# Altium schematic sheet PM.SchDoc
size A2; SPICEModelCacheVCNMBYVH: <root> / <DocumentId>VCNMBYVH</DocumentId> / <CacheFrame Number="0"> / <Model Name="mcp65r41_2402" Kind="CKT"> / <Text>.SUBCKT MCP65R41_2402 1 2 3 4 5 6 / *                     | | | | | | / *                     | | | | | VRef / *                     | | | | Output / *                     | | | Negative Supply / *                     | | Positive Supply / *                     | Inverting Input / *                     Non-inverting Input / * / ******************************************************************************** / * Software License Agreement                                                   * / *                                                                              * / * The software supplied herewith by Microchip Technology Incorporated (the     * / * 'Company') is intended and supplied to you, the Company's customer, for use  * / * soley and exclusively on Microchip products.                                 * / *                                                                              * / * The software is owned by the Company and/or its supplier, and is protected   * / * under applicable copyright laws. All rights are reserved. Any use in         * / * violation of the foregoing restrictions may subject the user to criminal     * / * sanctions under applicable laws, as well as to civil liability for the       * / * breach of the terms and conditions of this license.                          * / *                                                                              * / * THIS SOFTWARE IS PROVIDED IN AN 'AS IS' CONDITION. NO WARRANTIES, WHETHER    * / * EXPRESS, IMPLIED OR STATUTORY, INCLUDING, BUT NOT LIMITED TO, IMPLIED        * / * WARRANTIES OF MERCHANTABILITY AND FITNESS FOR A PARTICULAR PURPOSE APPLY TO  * / * THIS SOFTWARE. THE COMPANY SHALL NOT, IN ANY CIRCUMSTANCES, BE LIABLE FOR    * / * SPECIAL, INCIDENTAL OR CONSEQUENTIAL DAMAGES, FOR ANY REASON WHATSOEVER.     * / ******************************************************************************** / * / * The following op-amps are covered by this model: / *      MCP65R41_2402 / * / * / * Revision History: / *      REV A: 19-May-11, Created model / * / * / * / * / * Recommendations: / *      Use PSPICE (or SPICE 2G6; other simulators may require translation) / *      For a quick, effective design, use a combination of: data sheet / *            specs, bench testing, and simulations with this macromodel / *      For high impedance circuits, set GMIN=100F in the .OPTIONS statement / *      Can disable Hysteresis for faster response in large circuits by adding comments / *      in front of statements flagged below / * / * Supported: / *      Typical performance for temperature range (-40 to 125) degrees Celsius / *      DC, AC, Transient, and Noise analyses. / *      Most specs, including: offsets, DC PSRR, DC CMRR, input impedance, / *            open loop gain, voltage ranges, supply current, ... , etc. / *      Temperature effects for Ibias, Iquiescent, Iout short circuit / *            current, Vsat on both rails, Slew Rate vs. Temp and P.S. / * / * Not Supported: / *      Some Variation in specs vs. Power Supply Voltage / *      Vos distribution, Ib distribution for Monte Carlo / *      Distortion (detailed non-linear behavior) / *      Some Temperature analysis / *      Process variation / *      Behavior outside normal operating region / * / * / * / * Input Stage / * / V10  3 10 -500M / R10 10 11 218K / R11 10 12 218K / G10 10 11 10 11 458U / G11 10 12 10 12 458U / C11 11 12 1.82E-15 / C12  1  0 4.00P / *E12 71 14 POLY(6) 20 0 21 0 22 0 23 0 26 0 27 0   0.00 49.3K 49.3K 49.3K 49.3K 1 1 / E12 71 14 POLY(7) 20 0 21 0 22 0 23 0 26 0 27 0 111 0 / + 0.00 55 55 15 15 1 1 -.5M / *+ 1.5M 55 55 15 15 1 1 -.5M / * LINE ABOVE FOR HYSTERESIS, LINE BELOW FOR NO HYSTERESIS / *+ 1.5M 55 55 15 15 1 1 0 / G12 1 0 62 0 1m / G13 1 2 63 0 1u / M12 11 14 15 15 NMI / M14 12 2 15 15 NMI / G14 2 0 62 0 1m / C14  2  0 4.00P / I15 15 4 500U / V16 16 4 -300M / GD16 16 1 TABLE {V(16,1)} ((-100,-100E-15)(0,0)(1m,1u)(2m,1m)) / V13 3 13 -300M / GD13 2 13 TABLE {V(2,13)} ((-100,-100E-15)(0,0)(1m,1u)(2m,1m)) / R71  1  0 10.0E12 / R72  2  0 10.0E12 / R73  1  2 10.0E12 / C13  1  2 2.00P / * / * Noise, PSRR, and CMRR / * / I20 21 20 423U / D20 20  0 DN1 / D21  0 21 DN1 / I22 22 23 1N / R22 22 0  1k / R23  0 23 1k / G26  0 26 POLY(2) 3 0 4 0   0.00 -70.7U -125U / R26 26  0 1 / G27  0 27 POLY(2) 1 0 2 0  -2.19M 125U 125U / R27 27  0 1 / * / * Open Loop Gain, Slew Rate / * / G30  0 30 12 11 1 / R30 30  0 1.00K / G31 0 31 3 4 18.6 / I31 0 31 DC -82.1M / R31 31  0 1 TC=0.00,0.00 / GD31 30 0 TABLE {V(30,31)} ((-100,-1n)(0,0)(1m,0.1)(2m,2)) / G32 32 0 3 4 18.6 / I32 32 0 DC -82.1M / R32 32  0 1 TC=0.00,0.00 / GD32 0 30 TABLE {V(30,32)} ((-2m,2)(-1m,0.1)(0,0)(100,-1n)) / G33  0 33 30 0 1m / R33  33 0 1K / G34  0 34 33 0 1.00 / R34  34 0 1K / C34  34 0 15.9U / G37  0 37 34 0 1m / R37  37 0 1K / C37  37 0 15.9E-15 / G38  0 38 37 0 1m / R38  39 0 1K / L38  38 39 15.9N / E38  35 0 38 0 1 / G35 33 0 TABLE {V(35,3)} ((-1,-1n)(0,0)(2.00,1n))(2.2,1)) / G36 33 0 TABLE {V(35,4)} ((-2.2,-1)((-2.00,-1n)(0,0)(1,1n)) / * / * Output Stage / * / R80 50 0 100MEG / G50 0 50 57 96 2 / R58 57  96 0.50 / R57 57  0 10.0 / C58  5  0 2.00P / G57  0 57 POLY(3) 3 0 4 0 35 0 0 37.5M 50.0M 100M / GD55 55 57 TABLE {V(55,57)} ((-2m,-1)(-1m,-1m)(0,0)(10,1n)) / GD56 57 56 TABLE {V(57,56)} ((-2m,-1)(-1m,-1m)(0,0)(10,1n)) / E55 55  0 POLY(2) 3 0 51 0 4.7M 1 -48.5M / E56 56  0 POLY(2) 4 0 52 0 9.9M 1 -36.5M / R51 51 0 1k / R52 52 0 1k / GD51 50 51 TABLE {V(50,51)} ((-10,-1n)(0,0)(1m,1m)(2m,1)) / GD52 50 52 TABLE {V(50,52)}  ((-2m,-1)(-1m,-1m)(0,0)(10,1n)) / G53  3  0 POLY(1) 51 0  -500U 1M / G54  0  4 POLY(1) 52 0  -500U -1M / * / * Current Limit / * / G99 96 5 99 0 1 / R98 0 98 1 TC=-2.45M,-4.74U / G97 0 98 TABLE { V(96,5) } ((-11.0,-14.0M)(-1.00M,-13.8M)(0,0)(1.00M,13.8M)(11.0,14.0M)) / *E97 99 0 VALUE { V(98)*((V(3)-V(4))*738M + -1.21)} / E97 99 0 VALUE { V(98)*LIMIT(((V(3)-V(4))*738M + -1.21),0.00,1E6)} / D98 4 5 DESD / D99 5 3 DESD / * / * Temperature / Voltage Sensitive IQuiscent / * / R61 0 61 1 TC=3.54M,-1.28U / G61 3 4 61 0 1 / G60 0 61 TABLE {V(3, 4)} / *+ ((0,0)(600M,25.1N)(1.8,2.5U)(2.00,2.5U) / + ((0,0)(600M,25.1N)(0.85,0.50u)(1.15,2.5u)(1.2,3u)(1.35,3.7u)(1.4,3.8u)(1.45,3.7u)(1.5,2.5u)(1.8,2.5U)(2.00,2.5U) / + (3.00,2.5U)(5.00,2.51U)(6.00,2.52U)) / * / * Temperature Sensitive offset voltage / * / I73 0 70 DC 1uA / *R74 0 70 1 TC=10.0 / R74 0 70 1 TC=0.00 / E75 1 71 70 0 1 / * / * Temp Sensistive IBias / * / I62 0 62 DC 1uA / R62 0 62 REXP  349.81393U / * / * Temp Sensistive Offset IBias / * / I63 0 63 DC 1uA / R63 0 63 200M TC=12.0M,128U / * / * Hysteresis / * / G110 0 110 POLY(2) 3 0 4 0  10.4 -50M 50M / R110 110 0 1 TC=0.5M,0 / E111 111 0 VALUE { V(110) * V(112) } / E112 112 0 TABLE {V(120,0)} ((-1,1)(-1m,0.99)(1m,-0.99)(1,-1)) / C120  120 0  1u / G120 0 120 TABLE {V(57,4)} ((-1m,-1)(1m,1)) / R120 0 120 1 / C121 121 120 2p / C122 122 120 2p / V121 121 0 1 / V122 122 0 -1 / * Node 120 above is output of FF.  Can substitute with node 57 for / * direct input from output state. / * / * Begin - VRef Subcircuit Added 05-16-11 / * / R200 4 200  1 TC=3.35e-5,-4.55e-7 / E200 201 4 200 4 1 / VF200 202 6 0 / F200 3 4 VF200 1 / G200 201 202 TABLE { V(201, 202) } / + ( (-5.5,-0.010)(-1u,-500u)(0,0) (1u,500u)(5.5,0.012) ) / G201 4 200 TABLE { V(3, 4) } / + ( (0,0)(1.79,0.0)(1.80,1.80)(2.35,2.35)(2.37,2.37)(2.39,2.39)(2.40,2.40)(5.5,2.40)) / * / * End - VRef Subcircuit / * / * Models / .MODEL NMI NMOS(L=2.00U W=42.0U KP=20.0U LEVEL=1 ) / .MODEL DESD  D   N=1 IS=1.00E-15 / .MODEL DN1 D   IS=1P KF=50.0P AF=1 / .MODEL REXP  RES TCE= 7.71929 / .ENDS MCP65R41_2402</Text> / </Model> / </CacheFrame> / </root>
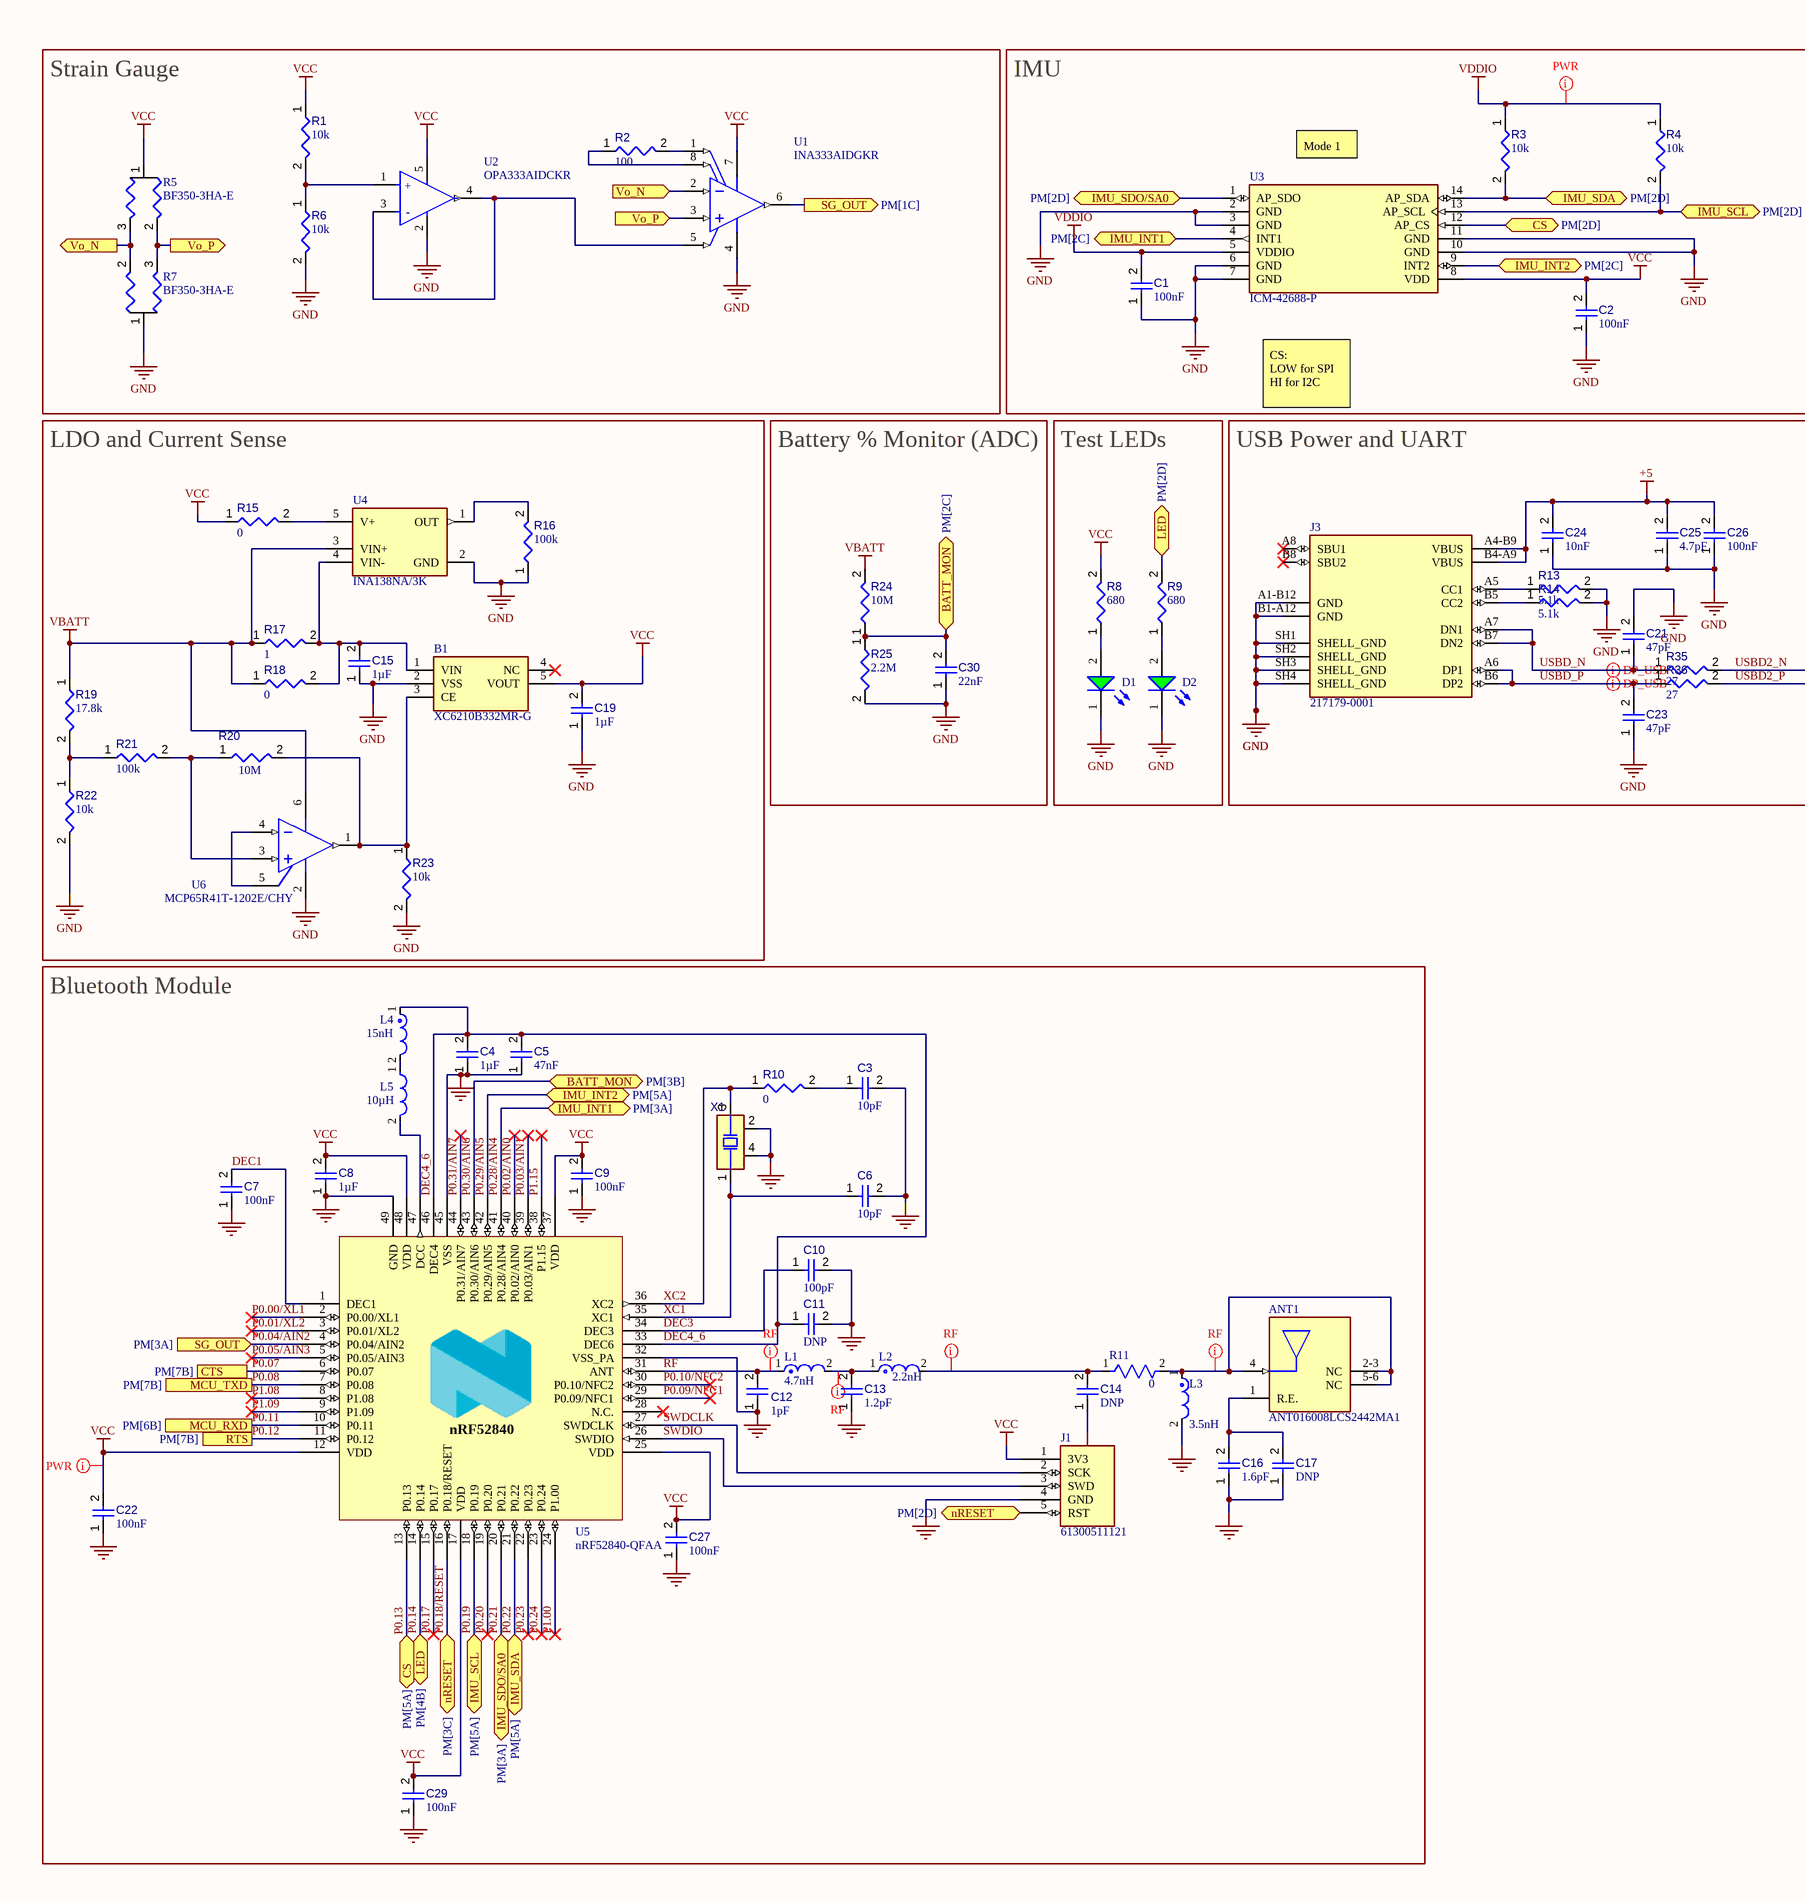
[diagram p0: PM.SchDoc, left]
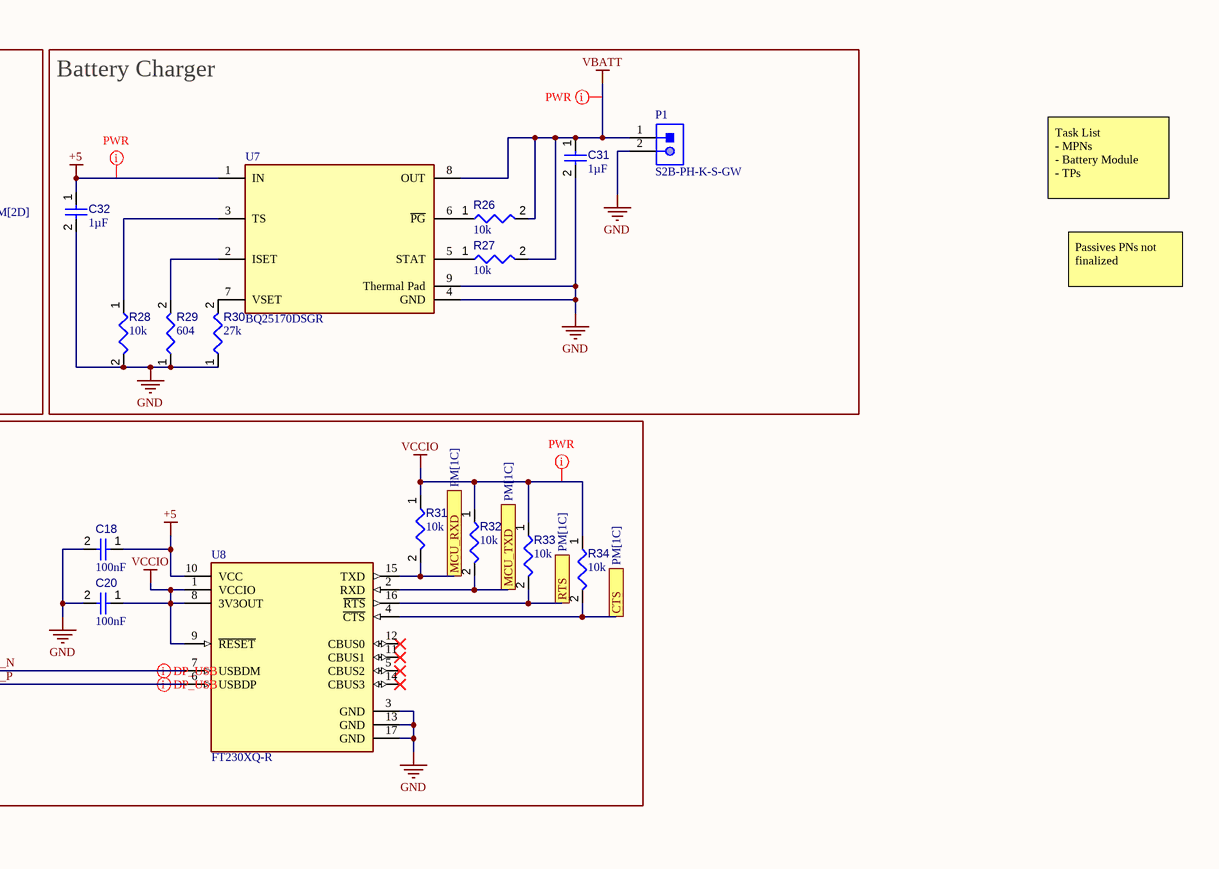
[diagram p1: PM.SchDoc, right]

## Parts
ANT1  ANT016008LCS2442MA1  [FP-ANT016-MFG]
B1  XC6210B332MR-G  [SOT95P280X130-5N]
C1  value 100nF  [FP-GRM15-IPC_B]  (hidden comment: GRM155R71C104KA88D)
C2  value 100nF  [FP-GRM15-IPC_B]  (hidden comment: GRM155R71C104KA88D)
C3  value 10pF  [FP-GRM155-0_05-IPC_C]  (hidden comment: GRM1555C1H100FA01D)
C4  value 1µF  [FP-GRM155-0_05-IPC_C]  (hidden comment: GRM155R70J105KA12D)
C5  value 47nF  [CAPC1608X90X35LL10T15]  (hidden comment: GRM188R71H473KA61D)
C6  value 10pF  [FP-GRM155-0_05-IPC_C]  (hidden comment: GRM1555C1H100FA01D)
C7  value 100nF  [FP-GRM15-IPC_B]  (hidden comment: GRM155R71C104KA88D)
C8  value 1µF  [FP-GRM155-0_05-IPC_C]  (hidden comment: GRM155R70J105KA12D)
C9  value 100nF  [FP-GRM15-IPC_B]  (hidden comment: GRM155R71C104KA88D)
C10  value 100pF  [CAPC1005X55X25LL05T10]  (hidden comment: GRM1555C1H101JA01D)
C11  value DNP  [CAPC0402(1005)33_L]  (hidden comment: Capacitor 680pF +/-20% 50V 0402)
C12  GJM0335C1H1R0BB01D  [FP-GJM033-0_03-IPC_B]  (value not drawn)
C13  value 1.2pF  [FP-GJM033-0_03-IPC_B]  (hidden comment: GJM0335C1H1R2BB01D)
C14  value DNP  [FP-GJM033-0_03-IPC_B]  (hidden comment: GJM0335C1H1R6BB01D)
C15  value 1µF  [FP-GRM155-0_05-IPC_C]  (hidden comment: GRM155R70J105KA12D)
C16  value 1.6pF  [FP-GJM033-0_03-ANT]  (hidden comment: GJM0335C1H1R6BB01D)
C17  value DNP  [FP-GJM033-0_03-ANT]  (hidden comment: GJM0335C1H1R6BB01D)
C18  value 100nF  [FP-GRM15-IPC_B]  (hidden comment: GRM155R71C104KA88D)
C19  value 1µF  [FP-GRM155-0_05-IPC_C]  (hidden comment: GRM155R70J105KA12D)
C20  value 100nF  [FP-GRM15-IPC_B]  (hidden comment: GRM155R71C104KA88D)
C21  value 47pF  [CAPC1005X55X25LL05T10]  (hidden comment: GRM1555C1H470JA01D)
C22  value 100nF  [FP-GRM15-IPC_B]  (hidden comment: GRM155R71C104KA88D)
C23  value 47pF  [CAPC1005X55X25LL05T10]  (hidden comment: GRM1555C1H470JA01D)
C24  value 10nF  [CAPC1005X55X25LL05T10]  (hidden comment: GRM155R71E103KA01D)
C25  value 4.7pF  [FP-GRM155-0_05-IPC_B]  (hidden comment: GRM1555C1H4R7CA01D)
C26  value 100nF  [FP-GRM15-IPC_B]  (hidden comment: GRM155R71C104KA88D)
C27  value 100nF  [FP-GRM15-IPC_B]  (hidden comment: GRM155R71C104KA88D)
C29  value 100nF  [FP-GRM15-IPC_B]  (hidden comment: GRM155R71C104KA88D)
C30  value 22nF  [FP-GRM155-0_05-MFG]  (hidden comment: GRM155R71E223JA61D)
C31  value 1µF  [FP-GRM155-0_05-IPC_C]  (hidden comment: GRM155R70J105KA12D)
C32  value 1µF  [FP-GRM155-0_05-IPC_C]  (hidden comment: GRM155R70J105KA12D)
D1  APHHS1005LCGCK  [LED_APHHS1005LCGCK]  (value not drawn)
D2  APHHS1005LCGCK  [LED_APHHS1005LCGCK]  (value not drawn)
J1  61300511121  [61300511121]
J3  217179-0001  [FP-2171790001-MFG]
L1  value 4.7nH  [FP-LQP03PN_02-IPC_B]  (hidden comment: LQP03PN4N7J02D)
L2  LQP03TN2N2B02D  [FP-LQP03TG_02-IPC_B]  (value not drawn)
L3  LQP03TN3N5B02D  [FP-LQP03TG_02-IPC_B]  (value not drawn)
L4  value 15nH  [FP-LQG15HH_02-IPC_B]  (hidden comment: LQG15HS15NJ02D)
L5  value 10µH  [FP-LQM18DN_70-IPC_C]  (hidden comment: LQM18DN100M70L)
P1  S2B-PH-K-S-GW  [JST-S2B-PH-K-S_V]
R1  value 10k  [FP-ERA2A-IPC_C]  (hidden comment: ERA-2AEB103X)
R2  value 100  [RESC1005X40X25NL05T05]  (hidden comment: ERJ-2GEJ101X)
R3  value 10k  [FP-ERA2A-IPC_C]  (hidden comment: ERA-2AEB103X)
R4  value 10k  [FP-ERA2A-IPC_C]  (hidden comment: ERA-2AEB103X)
R5  BF350-3HA-E  [BF350-3HA-E-Footprint-1]
R6  value 10k  [FP-ERA2A-IPC_C]  (hidden comment: ERA-2AEB103X)
R7  BF350-3HA-E  [BF350-3HA-E-Footprint-1]
R8  value 680  [FP-ERJ3EK-IPC_C]  (hidden comment: ERJ-3EKF6800V)
R9  value 680  [FP-ERJ3EK-IPC_C]  (hidden comment: ERJ-3EKF6800V)
R10  value 0  [RESC0402(1005)_L]  (hidden comment: ERJ-2GE0R00X)
R11  value 0  [FP-ERJ1GN-IPC_B]  (hidden comment: ERJ-1GN0R00C)
R13  value 5.1k  [RESC1005X40X25NL05T05]  (hidden comment: ERJ-2GEJ512X)
R14  value 5.1k  [RESC1005X40X25NL05T05]  (hidden comment: ERJ-2GEJ512X)
R15  value 0  [RESC0402(1005)_L]  (hidden comment: ERJ-2GE0R00X)
R16  value 100k  [RESC1005X40X25NL05T05]  (hidden comment: Resistor 100k +/-1% 0402 100 mW)
R17  value 1  [RESC1005X40X25NL05T10]  (hidden comment: RC0402FR-071RL)
R18  value 0  [RESC0402(1005)_L]  (hidden comment: ERJ-2GE0R00X)
R19  value 17.8k  [RESC1005X40X25NL05T10]  (hidden comment: RC0402FR-0717K8L)
R20  value 10M  [RESC1005X40N]  (hidden comment: RC0402FR-0710ML)
R21  value 100k  [RESC1005X40X25NL05T05]  (hidden comment: Resistor 100k +/-1% 0402 100 mW)
R22  value 10k  [FP-ERA2A-IPC_C]  (hidden comment: ERA-2AEB103X)
R23  value 10k  [FP-ERA2A-IPC_C]  (hidden comment: ERA-2AEB103X)
R24  value 10M  [RESC1005X40N]  (hidden comment: RC0402FR-0710ML)
R25  value 2.2M  [FP-CRCW0402-e3-IPC_B]  (hidden comment: CRCW04022M20FKED)
R26  value 10k  [FP-ERA2A-IPC_C]  (hidden comment: ERA-2AEB103X)
R27  value 10k  [FP-ERA2A-IPC_C]  (hidden comment: ERA-2AEB103X)
R28  value 10k  [FP-ERA2A-IPC_C]  (hidden comment: ERA-2AEB103X)
R29  value 604  [RESC1005X40X25NL05T05]  (hidden comment: ERJ-2RKF6040X)
R30  value 27k  [RESC1005X40X25NL05T05]  (hidden comment: ERJ-2RKF2702X)
R31  value 10k  [FP-ERA2A-IPC_C]  (hidden comment: ERA-2AEB103X)
R32  value 10k  [FP-ERA2A-IPC_C]  (hidden comment: ERA-2AEB103X)
R33  value 10k  [FP-ERA2A-IPC_C]  (hidden comment: ERA-2AEB103X)
R34  value 10k  [FP-ERA2A-IPC_C]  (hidden comment: ERA-2AEB103X)
R35  value 27  [RESC1005X40X25ML05T05]  (hidden comment: ERJ-2GEJ270X)
R36  value 27  [RESC1005X40X25ML05T05]  (hidden comment: ERJ-2GEJ270X)
U1  INA333AIDGKR  [DGK0008A_M]
U2  OPA333AIDCKR  [FP-DCK0005A-MFG]
U3  ICM-42688-P  [PQFN50P300X250X97-14N]
U4  INA138NA/3K  [FP-DBV0005A-IPC_C]
U5  nRF52840-QFAA  [QFN40P600X600X90-48N]
U6  MCP65R41T-1202E/CHY  [SOT-23-CHY6_M]
U7  BQ25170DSGR  [FP-DSG0008A-IPC_B]
U8  FT230XQ-R  [FP-QFN-16-IPC_A]
X1  FA-128 32.0000MF20X-K5  [BT-XTAL_2016]  (value not drawn)

## Blocks framed on the sheet
Strain Gauge: R1 R2 R5-R7 U1 U2
IMU: C1 C2 R3 R4 U3
Battery Charger: C31 C32 P1 R26-R30 U7
LDO and Current Sense: B1 C15 C19 R15-R23 U4 U6
Battery % Monitor (ADC): C30 R24 R25
Test LEDs: D1 D2 R8 R9
USB Power and UART: C18 C20 C21 C23-C26 J3 R13 R14 R31-R36 U8
Bluetooth Module: ANT1 C3-C14 C16 C17 C22 C27 C29 J1 L1-L5 R10 R11 U5 X1

## Ports
BATT_MON (bidir, see PM[2C]), BATT_MON (bidir, see PM[3B]), CS (bidir, see PM[2D]), CS (bidir, see PM[5A]), CTS (see PM[1C]), CTS (see PM[7B]), IMU_INT1 (bidir, see PM[2C]), IMU_INT1 (bidir, see PM[3A]), IMU_INT2 (bidir, see PM[2C]), IMU_INT2 (bidir, see PM[5A]), IMU_SCL (bidir, see PM[2D]), IMU_SCL (bidir, see PM[5A]), IMU_SDA (bidir, see PM[2D]), IMU_SDA (bidir, see PM[5A]), IMU_SDO/SA0 (bidir, see PM[2D]), IMU_SDO/SA0 (bidir, see PM[3A]), LED (bidir, see PM[2D]), LED (bidir, see PM[4B]), MCU_RXD (see PM[1C]), MCU_RXD (see PM[6B]), MCU_TXD (see PM[1C]), MCU_TXD (see PM[7B]), nRESET (bidir, see PM[2D]), nRESET (bidir, see PM[3C]), RTS (see PM[1C]), RTS (see PM[7B]), SG_OUT (in, see PM[3A]), SG_OUT (out, see PM[1C]), Vo_N (in, see PM[1A]), Vo_N (out, see PM[2A]), Vo_P (in, see PM[1A]), Vo_P (out, see PM[2A])

## Nets
+5: C18.1 C24.2 C25.2 C26.2 C32.1 J3.A4-B9(VBUS) J3.B4-A9(VBUS) U7.1(IN) U8.10(VCC)
GND: B1.2(VSS) C1.1 C2.1 C3.2 C4.1 C5.1 C6.2 C7.1 C8.1 C9.1 C10.2 C11.2 C12.1 C13.1 C14.1 C15.1 C16.1 C17.1 C18.2 C19.1 C20.2 C21.2 C22.1 C23.1 C24.1 C25.1 C26.1 C27.1 C29.1 C30.1 C31.2 C32.2 D1.1(K) D2.1(K) J1.4(GND) J3.A1-B12(GND) J3.B1-A12(GND) J3.SH1(SHELL_GND) J3.SH2(SHELL_GND) J3.SH3(SHELL_GND) J3.SH4(SHELL_GND) L3.2 P1.2 R6.2 R7.1 R13.2 R14.2 R16.1 R22.2 R23.2 R25.2 R28.2 R29.1 R30.1 U1.4(V-) U2.2(V-) U3.2(GND) U3.3(GND) U3.6(GND) U3.7(GND) U3.10(GND) U3.11(GND) U4.2(GND) U5.32(VSS_PA) U5.45(VSS) U5.49(GND) U6.2(VSS) U7.4(GND) U7.9(Thermal_Pad) U8.3(GND) U8.13(GND) U8.17(GND) X1.2(NC) X1.4(NC)
VBATT: C31.1 P1.1 R17.1 R18.1 R19.1 R24.2 R26.2 R27.2 U4.3(VIN+) U6.6(VDD) U7.8(OUT)
VCC: B1.5(VOUT) C2.2 C8.2 C9.2 C19.2 C22.2 C27.2 C29.2 J1.1(3V3) R1.1 R5.1 R8.2 R15.1 U1.7(V+) U2.5(V+) U3.8(VDD) U5.12(VDD) U5.17(VDD) U5.25(VDD) U5.37(VDD) U5.48(VDD)
VCCIO: C20.1 R31.1 R32.1 R33.1 R34.1 U8.1(VCCIO) U8.8(3V3OUT) U8.9(~{RESET})
VDDIO: C1.2 R3.1 R4.1 U3.5(VDDIO)
DEC1: C7.2 U5.1(DEC1)
DEC3: C10.1 U5.34(DEC3)
DEC4_6: C4.2 C5.2 C11.1 L4.1 U5.33(DEC6) U5.46(DEC4)
P0.00/XL1: U5.2(P0.00/XL1)
P0.01/XL2: U5.3(P0.01/XL2)
P0.02/AIN0: U5.40(P0.02/AIN0)
P0.03/AIN1: U5.39(P0.03/AIN1)
P0.04/AIN2: U1.6(VOUT) U5.4(P0.04/AIN2) ; port SG_OUT
P0.05/AIN3: U5.5(P0.05/AIN3)
P0.07: R34.2 U5.6(P0.07) U8.4(~{CTS}) ; port CTS
P0.08: R32.2 U5.7(P0.08) U8.2(RXD) ; port MCU_TXD
P0.09/NFC1: U5.29(P0.09/NFC1)
P0.10/NFC2: U5.30(P0.10/NFC2)
P0.11: R31.2 U5.10(P0.11) U8.15(TXD) ; port MCU_RXD
P0.12: R33.2 U5.11(P0.12) U8.16(~{RTS}) ; port RTS
P0.13: U3.12(AP_CS) U5.13(P0.13) ; port CS
P0.14: R9.2 U5.14(P0.14) ; port LED
P0.17: U5.15(P0.17)
P0.18/RESET: J1.5(RST) U5.16(P0.18/RESET) ; port nRESET
P0.19: R4.2 U3.13(AP_SCL) U5.18(P0.19) ; port IMU_SCL
P0.20: U5.19(P0.20)
P0.21: U3.1(AP_SDO) U5.20(P0.21) ; port IMU_SDO/SA0
P0.22: R3.2 U3.14(AP_SDA) U5.21(P0.22) ; port IMU_SDA
P0.23: U5.22(P0.23)
P0.24: U5.23(P0.24)
P0.28/AIN4: U3.4(INT1) U5.41(P0.28/AIN4) ; port IMU_INT1
P0.29/AIN5: U3.9(INT2) U5.42(P0.29/AIN5) ; port IMU_INT2
P0.30/AIN6: C30.2 R24.1 R25.1 U5.43(P0.30/AIN6) ; port BATT_MON
P0.31/AIN7: U5.44(P0.31/AIN7)
P1.00: U5.24(P1.00)
P1.08: U5.8(P1.08)
P1.09: U5.9(P1.09)
P1.15: U5.38(P1.15)
RF: C12.2 L1.1 U5.31(ANT)
SWDCLK: J1.2(SCK) U5.27(SWDCLK)
SWDIO: J1.3(SWD) U5.26(SWDIO)
USBD2_N: R35.2 U8.7(USBDM)
USBD2_P: R36.2 U8.6(USBDP)
USBD_N: C21.1 J3.A7(DN1) J3.B7(DN2) R35.1
USBD_P: C23.2 J3.A6(DP1) J3.B6(DP2) R36.1
Vo_N: R5.3 R7.2 U1.2(VIN-) ; port Vo_N
Vo_P: R5.2 R7.3 U1.3(VIN+) ; port Vo_P
XC1: C6.1 U5.35(XC1) X1.1(X1)
XC2: R10.1 U5.36(XC2) X1.3(X2)
NetANT1_1: ANT1.1(R.E.) C16.2 C17.2
NetANT1_2-3: ANT1.2-3(NC) ANT1.4(Feed_point) ANT1.5-6(NC) L3.1 R11.2
NetB1_1: B1.1(VIN) C15.2 R17.2 R18.2 U4.4(VIN-)
NetB1_3: B1.3(CE) R20.2 R23.1 U6.1(OUT)
NetC3_1: C3.1 R10.2
NetC13_2: C13.2 L1.2 L2.1
NetC14_2: C14.2 L2.2 R11.1
NetD1_2: D1.2(A) R8.1
NetD2_2: D2.2(A) R9.1
NetJ3_A5: J3.A5(CC1) R13.1
NetJ3_B5: J3.B5(CC2) R14.1
NetL4_2: L4.2 L5.1
NetL5_2: L5.2 U5.47(DCC)
NetR1_2: R1.2 R6.1 U2.1(+IN)
NetR2_1: R2.1 U1.8(RG)
NetR2_2: R2.2 U1.1(RG)
NetR15_2: R15.2 U4.5(V+)
NetR16_2: R16.2 U4.1(OUT)
NetR19_2: R19.2 R21.1 R22.1
NetR20_1: R20.1 R21.2 U6.3(VIN+)
NetR26_1: R26.1 U7.6(~{PG})
NetR27_1: R27.1 U7.5(STAT)
NetR28_1: R28.1 U7.3(TS)
NetR29_2: R29.2 U7.2(ISET)
NetR30_2: R30.2 U7.7(VSET)
NetU1_5: U1.5(REF) U2.3(-IN) U2.4(OUT)
NetU6_4: U6.4(VIN-) U6.5(VREF)

Not connected (* = marked no-connect by the designer): B1 4(NC)*; J3 A8(SBU1)* B8(SBU2)*; U5 28(N.C.)*; U8 5(CBUS2)* 11(CBUS1)* 12(CBUS0)* 14(CBUS3)*

## Layout directives
net class RF: NetANT1_2-3, NetC13_2, NetC14_2, RF
differential pair; differential pair class USB: USBD2_N, USBD2_P, USBD_N, USBD_P
net class PWR: +5, VBATT, VCC, VCCIO, VDDIO

## Notes on the sheet
- (near U3) Mode 1
- Task List
  - MPNs
  - Battery Module
  - TPs
- Passives PNs not finalized
- CS:
  LOW for SPI
  HI for I2C
- (near L2) 2.2nH
- (near C12) 1pF
- (near L3) 3.5nH
- (in symbol CMP-014-00005-1) +; -
- (in symbol CMP-051-000000-1) nRF52840

## Library data of the parts
ANT1 = CMP-00025-00005-2: RF/Microwave Antenna, 2400MHz Min, 2484MHz Max; Characteristic Impedance: 50R; RoHS Compliant: Yes; Construction: COMPONENT; Max Operating Temperature: 85°C; Min Operating Temperature: -40°C
B1 = CMP-037-000000-1: LDO Voltage Regulators 700mA High Speed Votage Regulator; Manufacturer_Name: Torex; Geometry.Height: 1.3mm; Design Item ID: XC6210B332MR-G; Mouser Part Number: 865-XC6210B332MR-G; Manufacturer_Part_Number: XC6210B332MR-G; Source: XC6210B332MR-G.SchLib; Mouser Price/Stock: https://www.mouser.co.uk/ProductDetail/Torex-Semiconductor/XC6210B332MR-G?qs=AsjdqWjXhJ%2FS4LOuBYdYHQ%3D%3D; Datasheet Link: https://www.torexsemi.com/file/xc6210/XC6210.pdf
C1 C2 C7 C9 C18 C20 C22 C26 C27 C29 = CMP-001-00099-3: Ceramic Capacitor, Multilayer, Ceramic, 16V, 10% +Tol, 10% -Tol, X7R, 15% TC, 0.1uF, Surface Mount, 0402; Multilayer: Yes; Dielectric Material: Ceramic; Termination: Wraparound; Height: 0.5mm; Package Shape: Rectangular; Packaging: Tape and Reel; RoHS Compliant: Yes; Case/Package: 0402; Tolerance (fill in as +-): 10%; Capacitor Type: Ceramic; Min Operating Temperature: -55°C; Rated DC Voltage (URdc): 16V; Pins: 2; Temperature Characteristics Code: X7R; Width: 0.5mm; Tolerance  (fill in as +-): 10%; Max Operating Temperature: 125°C; Reach SVHC Compliant: Yes; Terminal Finish: Nickel; Mounting Technology: Surface Mount; Length: 1mm; JESD-609 Code: e3; Package Style: SMTMeter
C3 C6 = CMP-001-00103-1: Ceramic Capacitor, Multilayer, Ceramic, 50V, 1% +Tol, 1% -Tol, C0G, 30ppm/Cel TC, 0.00001uF, Surface Mount, 0402; Multilayer: Yes; Termination: Wraparound; Mounting Technology: Surface Mount; Rated DC Voltage (URdc): 50V; Case/Package: 0402; Packaging: Tape and Reel; Terminal Finish: Nickel; Dielectric Material: Ceramic; Max Operating Temperature: 125°C; RoHS Compliant: Yes; Temperature Characteristics Code: C0G; Min Operating Temperature: -55°C; Tolerance  (fill in as +-): 1%; Capacitor Type: Ceramic; JESD-609 Code: e3; Pins: 2; Reach SVHC Compliant: Yes; Tolerance (fill in as +-): 1%; Package Shape: Rectangular
C4 C8 C15 C19 C31 C32 = CMP-001-00098-4: Ceramic Capacitor, Multilayer, Ceramic, 6.3V, 10% +Tol, 10% -Tol, X7R, 15% TC, 1uF, Surface Mount, 0402; Multilayer: Yes; Width: 0.5mm; Tolerance (fill in as +-): 10%; Termination: Wraparound; Package Style: SMTMeter; Tolerance  (fill in as +-): 10%; Temperature Characteristics Code: X7R; Min Operating Temperature: -55°C; Pins: 2; Height: 0.5mm; Reach SVHC Compliant: Yes; JESD-609 Code: e3; Case/Package: 0402; Mounting Technology: Surface Mount; Dielectric Material: Ceramic; Max Operating Temperature: 125°C; Capacitor Type: Ceramic; Packaging: Tape and Reel; Rated DC Voltage (URdc): 6.3V; Package Shape: Rectangular; Terminal Finish: Nickel; RoHS Compliant: Yes; Length: 1mm
C5 = CMP-001-00113-1: Ceramic Capacitor, Multilayer, Ceramic, 50V, 10% +Tol, 10% -Tol, X7R, 15% TC, 0.047uF, Surface Mount, 0603; Multilayer: Yes; Rated DC Voltage (URdc): 50V; Width: 0.8mm; Packaging: Tape and Reel; Capacitor Type: Ceramic; Package Style: SMTMeter; JESD-609 Code: e3; Case/Package: 0603; Pins: 2; Termination: Wraparound; Height: 0.8mm; Length: 1.6mm; Tolerance (fill in as +-): 10%; Package Shape: Rectangular; Max Operating Temperature: 125°C; Tolerance  (fill in as +-): 10%; Temperature Characteristics Code: X7R; RoHS Compliant: Yes; Mounting Technology: Surface Mount; Dielectric Material: Ceramic; Terminal Finish: Nickel; Min Operating Temperature: -55°C; Reach SVHC Compliant: Yes
C10 = CMP-001-00104-1: Ceramic Capacitor, Multilayer, Ceramic, 50V, 5% +Tol, 5% -Tol, C0G, 30ppm/Cel TC, 0.0001uF, Surface Mount, 0402; Multilayer: Yes; Pins: 2; Height: 0.5mm; Mounting Technology: Surface Mount; Capacitor Type: Ceramic; Tolerance (fill in as +-): 5%; Length: 1mm; Width: 0.5mm; Packaging: Tape and Reel; Termination: Wraparound; Package Shape: Rectangular; Case/Package: 0402; RoHS Compliant: Yes; JESD-609 Code: e3; Temperature Characteristics Code: C0G; Rated DC Voltage (URdc): 50V; Terminal Finish: Nickel; Tolerance  (fill in as +-): 5%; Package Style: SMTMeter; Min Operating Temperature: -55°C; Dielectric Material: Ceramic; Max Operating Temperature: 125°C; Reach SVHC Compliant: Yes
C11 = CMP-001-00070-3: Chip Capacitor, 680pF +/-20%, 50V, 0402, Thickness 0.33 mm; Tolerance: 10%; Max Operating Temperature: 85°C; Pins: 2; Min Operating Temperature: -55°C; Voltage Rating: 50V; Mounting Technology: SMT; Case/Package: 0402
C12 = CMP-001-00101-2: Ceramic Capacitor, Multilayer, Ceramic, 50V, 10% +Tol, 10% -Tol, C0G, 30ppm/Cel TC, 0.000001uF, Surface Mount, 0201; RoHS Compliant: Yes; Terminal Finish: Nickel; Dielectric Material: Ceramic; Reach SVHC Compliant: Yes; JESD-609 Code: e3; Pins: 2; Capacitor Type: Ceramic
C13 = CMP-001-00107-2: Ceramic Capacitor, Multilayer, Ceramic, 50V, 8.33% +Tol, 8.33% -Tol, C0G, 30ppm/Cel TC, 0.0000012uF, Surface Mount, 0201; Multilayer: Yes; Capacitor Type: Ceramic; Package Shape: Rectangular; Dielectric Material: Ceramic; Temperature Characteristics Code: C0G; Termination: Wraparound; Max Operating Temperature: 125°C; Case/Package: 0201; Terminal Finish: Nickel; Min Operating Temperature: -55°C; Rated DC Voltage (URdc): 50V; Packaging: Tape and Reel; JESD-609 Code: e3; Mounting Technology: Surface Mount; RoHS Compliant: Yes; Tolerance  (fill in as +-): 8.33%; Pins: 2; Tolerance (fill in as +-): 8.33%; Reach SVHC Compliant: Yes
C14 C16 C17 = CMP-001-00097-2: Ceramic Capacitor, Multilayer, Ceramic, 50V, 6.25% +Tol, 6.25% -Tol, C0G, 30ppm/Cel TC, 0.0000016uF, Surface Mount, 0201; Capacitor Type: Ceramic; Mounting Technology: Surface Mount; Min Operating Temperature: -55°C; Case/Package: 0201; RoHS Compliant: Yes; Pins: 2; Max Operating Temperature: 125°C; Dielectric Material: Ceramic
C21 C23 = CMP-001-00106-1: Ceramic Capacitor, Multilayer, Ceramic, 50V, 5% +Tol, 5% -Tol, C0G, 30ppm/Cel TC, 0.000047uF, Surface Mount, 0402; Multilayer: Yes; Temperature Characteristics Code: C0G; Termination: Wraparound; Pins: 2; Dielectric Material: Ceramic; JESD-609 Code: e3; Width: 0.5mm; Packaging: Tape and Reel; Height: 0.5mm; Package Shape: Rectangular; Tolerance (fill in as +-): 5%; Max Operating Temperature: 125°C; Length: 1mm; Terminal Finish: Nickel; Package Style: SMTMeter; Rated DC Voltage (URdc): 50V; Tolerance  (fill in as +-): 5%; RoHS Compliant: Yes; Capacitor Type: Ceramic; Min Operating Temperature: -55°C; Reach SVHC Compliant: Yes; Mounting Technology: Surface Mount; Case/Package: 0402
C24 = CMP-001-00105-1: Ceramic Capacitor, Multilayer, Ceramic, 25V, 10% +Tol, 10% -Tol, X7R, 15% TC, 0.01uF, Surface Mount, 0402; Multilayer: Yes; Width: 0.5mm; Package Shape: Rectangular; Min Operating Temperature: -55°C; Mounting Technology: Surface Mount; Dielectric Material: Ceramic; Temperature Characteristics Code: X7R; Rated DC Voltage (URdc): 25V; RoHS Compliant: Yes; Tolerance (fill in as +-): 10%; Termination: Wraparound; Terminal Finish: Nickel; Reach SVHC Compliant: Yes; Height: 0.5mm; Max Operating Temperature: 125°C; Package Style: SMTMeter; Case/Package: 0402; Tolerance  (fill in as +-): 10%; Capacitor Type: Ceramic; Pins: 2; Length: 1mm; Packaging: Tape and Reel; JESD-609 Code: e3
C25 = CMP-001-00112-1: Ceramic Capacitor, Multilayer, Ceramic, 50V, 5.32% +Tol, 5.32% -Tol, C0G, 30ppm/Cel TC, 0.0000047uF, Surface Mount, 0402; Pins: 2; Dielectric Material: Ceramic; Height: 0.5mm; Max Operating Temperature: 125°C; RoHS Compliant: Yes; Capacitor Type: Ceramic; Min Operating Temperature: -55°C; Mounting Technology: Surface Mount; Case/Package: 0402
C30 = CMP-001-00110-1: Ceramic Capacitor, Multilayer, Ceramic, 25V, 5% +Tol, 5% -Tol, X7R, 15% TC, 0.022uF, Surface Mount, 0402; Multilayer: Yes; Mounting Technology: Surface Mount; Package Shape: Rectangular; Case/Package: 0402; Tolerance (fill in as +-): 5%; Packaging: Tape and Reel; Min Operating Temperature: -55°C; Termination: Wraparound; Max Operating Temperature: 125°C; Dielectric Material: Ceramic; Pins: 2; JESD-609 Code: e3; Reach SVHC Compliant: Yes; Tolerance  (fill in as +-): 5%; Temperature Characteristics Code: X7R; Capacitor Type: Ceramic; RoHS Compliant: Yes; Terminal Finish: Nickel; Rated DC Voltage (URdc): 25V
D1 D2 = CMP-004-00031-2: Green 570nm LED Indication - Discrete 1.9V 0402 (1005 Metric); MF: Kingbright; SnapEDA_Link: https://www.snapeda.com/parts/APHHS1005LCGCK/Kingbright/view-part/?ref=snap; Value: *; Check_prices: https://www.snapeda.com/parts/APHHS1005LCGCK/Kingbright/view-part/?ref=eda; Case/Package: 0402 Kingbright Corporation; Design Item ID: APHHS1005LCGCK; Source: APHHS1005LCGCK.SchLib; Pins: 2; Component Type: Standard; MP: APHHS1005LCGCK
J1 = CMP-002-00073-4: Board Connector, 5 Contact(s), 1 Row(s), Male, Straight, 0.1 inch Pitch, Solder Terminal, Locking, Black Insulator, Plug; Body Length: 0.5inch; Body Depth: 0.1inch; Mounting Technology: Board; Max Operating Temperature: 125°C; Body Breadth: 0.1inch; Body/Shell Style: PLUG; Connector Type: BOARD CONNECTOR; Min Operating Temperature: -40°C; RoHS Compliant: Yes
J3 = CMP-002-00078-2: USB Connector, 16 Contact(s), Female, Right Angle, Surface Mount Terminal, Locking, Receptacle
L1 = CMP-006-00026-1: Inductor RF Chip Thick Film 0.0047uH 5% 500MHz 10Q-Factor 0.9A 0.14Ohm DCR 0201 T/R; Self Resonant Frequency: 4.4GHz; Current Rating: 900mA; Max Operating Temperature: 125°C; Mounting Technology: Surface Mount; Case Code (Metric): 0603; Tolerance: 5%; Case/Package: 0201; RoHS Compliant: Yes; Case Code (Imperial): 0201; Min Operating Temperature: -55°C
L2 = CMP-006-00028-1: General Purpose Inductor, 0.0022uH, 4.545%, 1 Element, SMD, 0201; Self Resonant Frequency: 11GHz; Max Current Rating: 600mA; Package Width: 0.3mm; Inductor Application: RF INDUCTOR; Package Length: 0.6mm; Test Frequency: 500MHz; Shielding: Unshielded; Channels: 1; Case/Size Code: 0201; Shape/Size Description: RECTANGULAR PACKAGE; DC Resistance (DCR): 150mR; Quality Factor-Min (at L-nom): 14; Min Operating Temperature: -55°C; RoHS Compliant: Yes; Tolerance: 4.545%; Terminal Placement: Dual Ended; Surface Mount: Yes; Pins: 2; Reach SVHC Compliant: Yes; Max Operating Temperature: 125°C; Inductance-Nom (L): 0.0022uH; Construction: Chip; JESD-609 Code: e3; Packaging: Tape and Reel; Terminal Finish: Nickel; Inductor Type: GENERAL PURPOSE INDUCTOR; Package Style: SMTMeter; Termination: Wraparound; Package Height: 0.3mm
L3 = CMP-006-00027-1: General Purpose Inductor, 0.0035uH, 2.857%, 1 Element, SMD, 0201; DC Resistance (DCR): 250mR; Package Height: 0.3mm; Max Current Rating: 450mA; Self Resonant Frequency: 7GHz; Case/Size Code: 0201; Quality Factor-Min (at L-nom): 14; Shielding: Unshielded; Shape/Size Description: RECTANGULAR PACKAGE; Inductor Application: RF INDUCTOR; Package Length: 0.6mm; Channels: 1; Test Frequency: 500MHz; RoHS Compliant: Yes; Inductor Type: GENERAL PURPOSE INDUCTOR; Terminal Placement: Dual Ended; Terminal Finish: Tin; Max Operating Temperature: 125°C; Construction: Chip; Pins: 2; Tolerance: 2.857%; Termination: Wraparound; Min Operating Temperature: -55°C; Package Width: 0.3mm; Packaging: Tape and Reel; Inductance-Nom (L): 0.0035uH; JESD-609 Code: e3; Surface Mount: Yes; Package Style: SMTMeter; Reach SVHC Compliant: Yes
L4 = CMP-006-00029-1: General Purpose Inductor, 0.015uH, 5%, 1 Element, Air-Core, SMD, 0402; DC Resistance (DCR): 320mR; Case/Size Code: 0402; Core Material: Air; Max Current Rating: 450mA; Self Resonant Frequency: 2.5GHz; Pins: 2; Max Operating Temperature: 125°C; Tolerance: 5%; RoHS Compliant: Yes; Min Operating Temperature: -55°C; Construction: Multilayer Chip
L5 = CMP-006-00030-1: General Purpose Inductor, 10uH, 20%, 1 Element, Ferrite-Core, SMD, 0603
P1 = CMP-002-00030-3: S2B Series 2 Circuit 2 mm Pitch Side Entry Through Hole Shrouded Header; Manufacturer: Japan Solderless Terminals; Gender: Male; Datasheet Version: Dec-12; Package Description: Male Header, Pitch 2 mm, 1 x 2 Position, Height 4.8 mm, Tail Length 3.4 mm; Case/Package: S2B-PH-K-S; Min Operating Temperature: -25°C; Package Reference: S2B-PH-K-S; Connector Type: Header; Max Operating Temperature: 85°C; Datasheet URL: http://www.jst-mfg.com/product/pdf/eng/ePH.pdf; Mounting Technology: SM; RoHS Compliant: Unknown
R1 R3 R4 R6 R22 R23 R26-R28 R31-R34 = CMP-009-00193-1: Fixed Resistor, Thin Film, 0.063W, 10000ohm, 50V, 0.1% +/-Tol, 25ppm/Cel, Surface Mount, 0402; Power: 63mW; Working Voltage: 25V; Reference Standard: AEC-Q200; Package Height: 0.35mm; Package Length: 1mm; Rated Temperature: 85°C; Temperature Coefficient (ppm/Cel): 25; Package Width: 0.5mm; Construction: Rectangular; Packaging: Tape and Reel; Min Operating Temperature: -55°C; Technology: THIN FILM; Reach SVHC Compliant: Yes; Mounting Technology: Surface Mount; Termination: Wraparound; Case/Package: 0402; Tolerance: 0.1%; Pins: 2; JESD-609 Code: e3; Resistor Type: FIXED RESISTOR; RoHS Compliant: Yes; Terminal Finish: Nickel; Max Operating Temperature: 155°C
R2 = CMP-009-00192-1: Fixed Resistor, Metal Glaze/thick Film, 0.1W, 100ohm, 50V, 5% +/-Tol, 200ppm/Cel, Surface Mount, 0402; Package Width: 0.5mm; Rated Temperature: 70°C; Package Height: 0.35mm; Temperature Coefficient (ppm/Cel): 200; Power: 100mW; Package Length: 1mm; Reference Standard: AEC-Q200; JESD-609 Code: e3; Min Operating Temperature: -55°C; Working Voltage: 50V; Technology: METAL GLAZE/THICK FILM; Packaging: Tape and Reel; Case/Package: 0402; Construction: Rectangular; Terminal Finish: Nickel; Resistor Type: FIXED RESISTOR; Termination: Wraparound; Tolerance: 5%; Mounting Technology: Surface Mount; Max Operating Temperature: 155°C; Pins: 2; Package Shape: Rectangular; Reach SVHC Compliant: Yes; RoHS Compliant: Yes
R5 R7 = CMP-009-00177-2: STRAIN GAUGE, SHEAR, 350OHM +/- 3OHM; Design Item ID: BF350-3HA-E; Pins: 3; Source: Power_Meter.SchLib
R8 R9 = CMP-009-00195-1: Fixed Resistor, Metal Glaze/thick Film, 0.1W, 680ohm, 75V, 1% +/-Tol, 100ppm/Cel, Surface Mount, 0603; Temperature Coefficient (ppm/Cel): 100; Reference Standard: AEC-Q200; Package Length: 1.6mm; Package Width: 0.8mm; Rated Temperature: 70°C; Package Height: 0.45mm; Power: 100mW; Resistor Type: FIXED RESISTOR; Max Operating Temperature: 155°C; JESD-609 Code: e3; Technology: METAL GLAZE/THICK FILM; Construction: Rectangular; RoHS Compliant: Yes; Packaging: Tape and Reel; Case/Package: 0603; Reach SVHC Compliant: Yes; Terminal Finish: Nickel; Package Shape: Rectangular; Tolerance: 1%; Termination: Wraparound; Min Operating Temperature: -55°C; Pins: 2; Working Voltage: 75V; Mounting Technology: Surface Mount
R10 R15 R18 = CMP-009-00148-3: Jumper 0402; Pins: 2; Max Operating Temperature: 155°C; Min Operating Temperature: -55°C; Case/Package: 0402
R11 = CMP-009-00190-2: Zero Ohm Resistor, Jumper, 0201 [0603 Metric], Thick Film, 50 mW, 500 mA, Surface Mount; Voltage Rating: 25V; Tolerance: 1%; Case/Package: 0201; Min Operating Temperature: -55°C; Case Code (Imperial): 0201; RoHS Compliant: Yes; Mounting Technology: Surface Mount; Max Operating Temperature: 125°C; Contact Plating: Tin; Case Code (Metric): 0603
R13 R14 = CMP-009-00191-1: Fixed Resistor, Metal Glaze/thick Film, 0.1W, 5100ohm, 50V, 5% +/-Tol, 200ppm/Cel, Surface Mount, 0402; Reference Standard: AEC-Q200; Power: 100mW; Rated Temperature: 70°C; Temperature Coefficient (ppm/Cel): 200; Package Width: 0.5mm; Package Length: 1mm; Package Height: 0.35mm; Technology: METAL GLAZE/THICK FILM; Packaging: Tape and Reel; Tolerance: 5%; Pins: 2; Mounting Technology: Surface Mount; Resistor Type: FIXED RESISTOR; Working Voltage: 50V; Min Operating Temperature: -55°C; RoHS Compliant: Yes; Max Operating Temperature: 155°C; Package Shape: Rectangular; Case/Package: 0402; Construction: Rectangular; JESD-609 Code: e3; Terminal Finish: Nickel; Termination: Wraparound; Reach SVHC Compliant: Yes
R16 R21 = CMP-009-00022-5: Chip Resistor, 100 KOhm, +/- 1%, 0.1 W, -55 to 155 degC, 0402 (1005 Metric); Power: 100mW; Voltage Rating: 50V; Mounting Technology: SM; Pins: 2; Min Operating Temperature: -55°C; Tolerance: 1%; RoHS Compliant: True; Case/Package: 0402; Max Operating Temperature: 155°C
R17 = CMP-009-00183-1: Fixed Resistor, Metal Glaze/thick Film, 0.0625W, 1ohm, 50V, 1% +/-Tol, 200ppm/Cel, Surface Mount, 0402; Rated Temperature: 70°C; Package Width: 0.5mm; Power: 62.5mW; Package Height: 0.35mm; Additional Feature: LASER TRIMMABLE; Temperature Coefficient (ppm/Cel): 200; Package Length: 1mm; Packaging: Tape and Reel; Case/Package: 0402; Working Voltage: 50V; Min Operating Temperature: -55°C; Max Operating Temperature: 155°C; Resistor Type: FIXED RESISTOR; RoHS Compliant: Yes; Reach SVHC Compliant: Yes; Pins: 2; Mounting Technology: Surface Mount; Package Shape: Rectangular; JESD-609 Code: e3; Terminal Finish: Nickel; Construction: Chip; Tolerance: 1%; Termination: Wraparound; Technology: METAL GLAZE/THICK FILM
R19 = CMP-009-00194-1: Fixed Resistor, Metal Glaze/thick Film, 0.0625W, 17800ohm, 50V, 1% +/-Tol, 100ppm/Cel, Surface Mount, 0402; Power: 62.5mW; Temperature Coefficient (ppm/Cel): 100; Rated Temperature: 70°C; Package Width: 0.5mm; Package Height: 0.35mm; Additional Feature: LASER TRIMMABLE; Package Length: 1mm; Packaging: Tape and Reel; Mounting Technology: Surface Mount; Terminal Finish: Nickel; Pins: 2; Resistor Type: FIXED RESISTOR; Package Shape: Rectangular; Min Operating Temperature: -55°C; RoHS Compliant: Yes; Technology: METAL GLAZE/THICK FILM; Case/Package: 0402; Max Operating Temperature: 155°C; Tolerance: 1%; Working Voltage: 50V; Termination: Wraparound; Construction: Chip; JESD-609 Code: e3; Reach SVHC Compliant: Yes
R20 R24 = CMP-009-00179-2: 10 MOhms Â±1% 0.063W, 1/16W Chip Resistor 0402 (1005 Metric) Moisture Resistant Thick Film; MF: Yageo; Design Item ID: RC0402FR-0710ML; MP: RC0402FR-0710ML; Price: None; Component Type: Standard; DigiKey-Purchase-URL: https://snapeda.com/shop?store=DigiKey&id=106124; SnapEDA_Link: https://www.snapeda.com/parts/RC0402FR-0710ML/Yageo/view-part/106124/?ref=snap; Case/Package: 1005 Panasonic Electronic Components; Arrow_Electronics-Purchase-URL: https://snapeda.com/shop?store=Arrow+Electronics&id=106124; Source: RC0402FR-0710ML.SchLib; Availability: Good; Pins: 2; Mouser-Purchase-URL: https://snapeda.com/shop?store=Mouser&id=106124
R25 = CMP-009-00184-2: Fixed Resistor, Metal Glaze/thick Film, 0.063W, 2200000ohm, 50V, 1% +/-Tol, 100ppm/Cel, Surface Mount, 0402; Package Length: 1mm; Power: 63mW; Rated Temperature: 70°C; Temperature Coefficient (ppm/Cel): 100; Package Width: 0.5mm; Reference Standard: AEC-Q200; Package Height: 0.35mm; Termination: Wraparound; Min Operating Temperature: -55°C; Package Shape: Rectangular; Technology: METAL GLAZE/THICK FILM; Max Operating Temperature: 155°C; Resistor Type: FIXED RESISTOR; Terminal Finish: Nickel; Tolerance: 1%; Case/Package: 0402; Pins: 2; JESD-609 Code: e3; RoHS Compliant: Yes; Construction: Chip; Working Voltage: 50V; Packaging: Tape and Reel; Mounting Technology: Surface Mount; Reach SVHC Compliant: Yes
R29 = CMP-009-00185-1: Fixed Resistor, Metal Glaze/thick Film, 0.1W, 604ohm, 50V, 1% +/-Tol, 100ppm/Cel, Surface Mount, 0402; Temperature Coefficient (ppm/Cel): 100; Package Width: 0.5mm; Package Length: 1mm; Power: 100mW; Rated Temperature: 70°C; Package Height: 0.35mm; Reference Standard: AEC-Q200; Mounting Technology: Surface Mount; Terminal Finish: Nickel; Resistor Type: FIXED RESISTOR; Technology: METAL GLAZE/THICK FILM; Packaging: Tape and Reel; Tolerance: 1%; Package Shape: Rectangular; Min Operating Temperature: -55°C; Working Voltage: 50V; RoHS Compliant: Yes; Case/Package: 0402; Construction: Rectangular; Termination: Wraparound; Pins: 2; Max Operating Temperature: 155°C; JESD-609 Code: e3; Reach SVHC Compliant: Yes
R30 = CMP-009-00186-1: Fixed Resistor, Metal Glaze/thick Film, 0.1W, 27000ohm, 50V, 1% +/-Tol, 100ppm/Cel, Surface Mount, 0402; Package Length: 1mm; Power: 100mW; Package Height: 0.35mm; Reference Standard: AEC-Q200; Package Width: 0.5mm; Temperature Coefficient (ppm/Cel): 100; Rated Temperature: 70°C; JESD-609 Code: e3; RoHS Compliant: Yes; Reach SVHC Compliant: Yes; Tolerance: 1%; Technology: METAL GLAZE/THICK FILM; Termination: Wraparound; Packaging: Tape and Reel; Working Voltage: 50V; Max Operating Temperature: 155°C; Pins: 2; Case/Package: 0402; Resistor Type: FIXED RESISTOR; Package Shape: Rectangular; Min Operating Temperature: -55°C; Terminal Finish: Nickel; Mounting Technology: Surface Mount; Construction: Rectangular
R35 R36 = CMP-009-00196-1: Fixed Resistor, Metal Glaze/thick Film, 0.1W, 27ohm, 50V, 5% +/-Tol, 200ppm/Cel, Surface Mount, 0402; Power: 100mW; Case/Package: 0402; Min Operating Temperature: -55°C; RoHS Compliant: Yes; Mounting Technology: Surface Mount; Pins: 2; Tolerance: 5%; Max Operating Temperature: 155°C
U1 = CMP-014-00004-2: Instrumentation Amplifier, 1 Func, 25uV Offset-Max, 0.15MHz Band Width, PDSO8; Common Mode Rejection Ratio-Min: 80dB; Average Bias Current-Max (IIB): 200pA; Channels: 1; Bandwidth (3dB)-Nom: 150kHz; Nominal Supply Voltage: 5V; Max Operating Temperature: 125°C; Min Operating Temperature: -40°C; Pins: 8; Case/Package: TSSOP; Amplifier Type: INSTRUMENTATION AMPLIFIER; RoHS Compliant: Yes
U2 = CMP-014-00005-1: Operational Amplifier, 1 Func, 10uV Offset-Max, CMOS, PDSO5; Nominal Supply Voltage: 5V; Average Bias Current-Max (IIB): 200pA; Architecture: VOLTAGE-FEEDBACK; Channels: 1; Power: 0W; Bias Current-Max (IIB) @25C: 200pA; Amplifier Type: OPERATIONAL AMPLIFIER; Case/Package: TSSOP; RoHS Compliant: Yes; Pins: 5; Min Operating Temperature: -40°C; Max Operating Temperature: 125°C
U3 = CMP-010-00025-3: Accelerometer, Gyroscope, 6 Axis Sensor Output; Availability: Unavailable; Price: None; Pins: 14; Component Type: Standard; Value: *; Source: ICM-42688-P.SchLib; MP: ICM-42688-P; Design Item ID: ICM-42688-P; Case/Package: None
U4 = CMP-019-00050-1: Operational Amplifier, 1 Func, PDSO5; Package Equivalence Code: TSOP5/6,.11,37; Throw Configuration: POWER SUPPLY SUPPORT CIRCUIT; Package Body Material: Plastic; Max Supply Voltage: 36V; Number of Channels: 1; Qualification Status: Not Qualified; Nominal Supply Voltage: 5V; Min Supply Voltage: 2.7V; Adjustable Threshold: No; Power Supplies: 3/36V; Supply Current-Max (Isup): 45uA; Temperature Grade: AUTOMOTIVE; JESD-609 Code: e4; Package Style: SMALL OUTLINE, LOW PROFILE, SHRINK PITCHMeter; JESD-30 Code: R-PDSO-G5; Height - Seated (Max): 1.45mm; Surface Mount: Yes; Pins: 5; Width: 1.6mm; RoHS Compliant: Yes; Moisture Sensitivity Level: 2; Technology: BICMOS; Terminal Pitch: 0.95mm; Case/Package: LSSOP; Length: 2.9mm; Reach SVHC Compliant: Yes; Terminal Form: Gull Wing; Channels: 1; Peak Reflow Temperature (Cel): 260°C; Package Shape: Rectangular; Terminal Position: DUAL; Max Operating Temperature: 125°C; Terminal Finish: Nickel; Min Operating Temperature: -40°C
U5 = CMP-051-000000-1: Multi-protocol Bluetooth Low Energy, IEEE 802.15.4, ANT and 2.4GHz proprietary system-on-chip; Pad Count: 48; Design Item ID: nRF52840-QFAA; Published: 2016-03-31; Part Number: nRF52840-QFAA; Footprint Doc: QFN-48; Value: nRF52840-QFAA; Component Class: nRF_Devices; LatestRevisionDate: 2016-11-22; Source: nrf52840_qfaa.SCHLIB
U6 = CMP-031-00007-1: Comparator, 1 Func, 10000uV Offset-Max, 4000ns Response Time, CMOS, PDSO6; Input Offset Voltage-Max: 10mV; Time @ Peak Reflow Temperature-Max (s): 40s; Nominal Supply Voltage: 5V; Package Body Material: Plastic; Output Type: PUSH-PULL; Power Supplies: 2.5V; Qualification Status: Not Qualified; Package Equivalence Code: TSOP6,.11,37; Channels: 1; Supply Voltage Limit-Max: 7V; Average Bias Current-Max (IIB): 5nA; Max Supply Current: 4uA; Technology: CMOS; Package Shape: Rectangular; JESD-609 Code: e4; Terminal Finish: Nickel; Moisture Sensitivity Level: 1; Pins: 6; Length: 2.9mm; Min Operating Temperature: -40°C; Temperature Grade: AUTOMOTIVE; JESD-30 Code: R-PDSO-G6; Terminal Form: Gull Wing; Terminal Position: DUAL; Surface Mount: Yes; Max Operating Temperature: 125°C; Width: 1.55mm; RoHS Compliant: Yes; Amplifier Type: COMPARATOR; Terminal Pitch: 0.95mm; Peak Reflow Temperature (Cel): 260°C; Reach SVHC Compliant: Yes; Package Style: SMALL OUTLINE, LOW PROFILE, SHRINK PITCHMeter; Case/Package: LSSOP; Height - Seated (Max): 1.45mm; Response Time-Nom: 4000ns
U7 = CMP-019-00051-1: Power Supply Support Circuit, Adjustable, 1 Channel, PDSO8; RoHS Compliant: Yes
U8 = CMP-015-00008-1: Microprocessor Circuit, CMOS, PQCC16; Min Supply Voltage: 2.97V; Nominal Supply Voltage: 5V; Max Supply Voltage: 5.5V; Height - Seated (Max): 0.9mm; Max Operating Temperature: 85°C; Case/Package: HVQCCN; Min Operating Temperature: -40°C; Pins: 16; JESD-30 Code: S-PQCC-N16; Length: 4mm; RoHS Compliant: Yes; JESD-609 Code: e3
X1 = CMP-003-00035-2: 32 MHz ±10ppm Crystal 10pF 60 Ohms 4-SMD, No Lead; ESR: 80; Load Capacitance: 12pF; Frequency: 24MHz; Crystal/Resonator Type: PARALLEL - FUNDAMENTAL; Min Operating Temperature: -20°C; Reach SVHC Compliant: Yes; Max Operating Temperature: 75°C; JESD-609 Code: e4; RoHS Compliant: Yes; Pins: 4; Mounting Technology: SMT; Case/Package: SMD/SMT